# Altium schematic sheet STM32F103C8T6.SchDoc: STM32最小系统
size A4; Author: LiuShiming; Organization: Author:LiuShiming; DocumentNumber: 1; Revision: V2; SheetNumber: 1; SheetTotal: 1; Time: 20220215
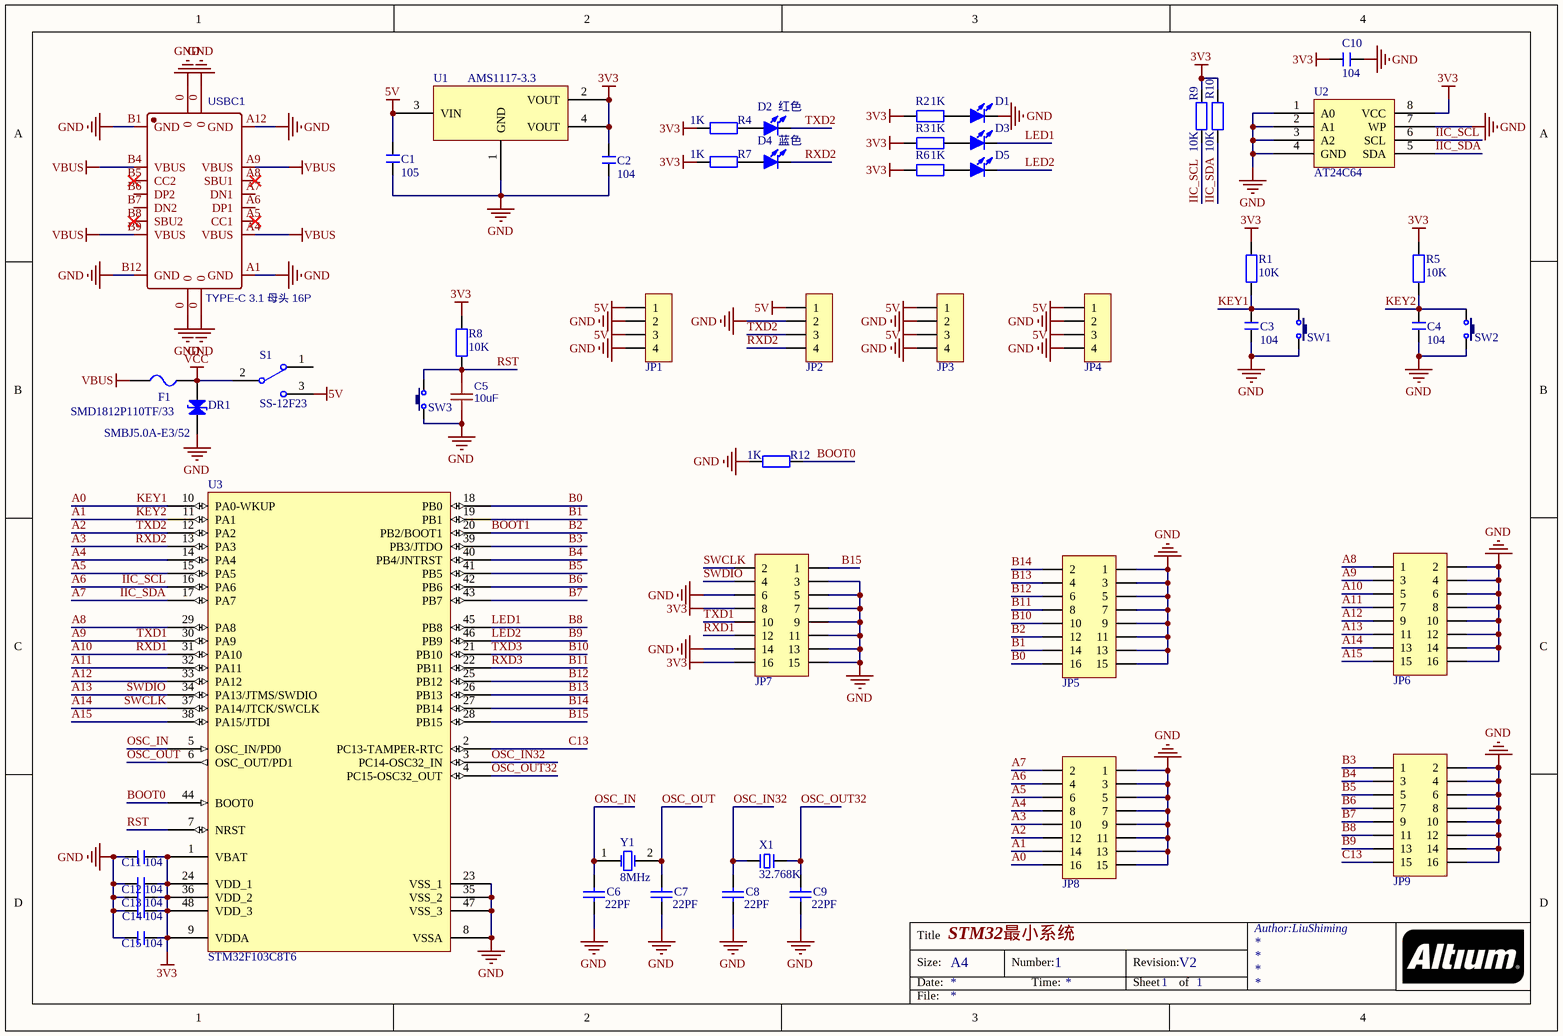
[diagram p0: STM32F103C8T6.SchDoc]

## Parts
C1  105  [C 0603]
C2  104  [C 0603]
C3  104  [C 0603]
C4  104  [C 0603]
C5  10uF  [C 0603]
C6  22PF  [C 0603]
C7  22PF  [C 0603]
C8  22PF  [C 0603]
C9  22PF  [C 0603]
C10  104  [C 0603]
C11  104  [C 0603]
C12  104  [C 0603]
C13  104  [C 0603]
C14  104  [C 0603]
C15  104  [C 0603]
D1  红色  [LED 0603R]  (value not drawn)
D2  红色  [LED 0603R]
D3  蓝色  [LED 0603B]  (value not drawn)
D4  蓝色  [LED 0603B]
D5  黄色  [LED 0603Y]  (value not drawn)
DR1  SMBJ5.0A-E3/52  [SMB]
F1  SMD1812P110TF/33  [FU 0805]
JP1  HDR-1X4  [HDR-1X4]  (value not drawn)
JP2  HDR-1X4  [HDR-1X4]  (value not drawn)
JP3  HDR-1X4  [HDR-1X4]  (value not drawn)
JP4  HDR-1X4  [HDR-1X4]  (value not drawn)
JP5  Header 8X2  [HD8X2]  (value not drawn)
JP6  Header 8X2  [HD8X2]  (value not drawn)
JP7  Header 8X2  [HD8X2]  (value not drawn)
JP8  Header 8X2  [HD8X2]  (value not drawn)
JP9  Header 8X2  [HD8X2]  (value not drawn)
R1  10K  [R 0603]
R2  1K  [R 0603]
R3  1K  [R 0603]
R4  1K  [R 0603]
R5  10K  [R 0603]
R6  1K  [R 0603]
R7  1K  [R 0603]
R8  10K  [R 0603]
R9  10K  [R 0603]
R10  10K  [R 0603]
R12  1K  [R 0603]
S1  SS-12F23  [MSK-12C01-07]
SW1  3x6x5  [TSW SMD-3*6*4.3]  (value not drawn)
SW2  3x6x5  [TSW SMD-3*6*4.3]  (value not drawn)
SW3  3x6x5  [TSW SMD-3*6*4.3]  (value not drawn)
U1  AMS1117-3.3  [SOT223_N]
U2  AT24C64  [SOP8_N]
U3  STM32F103C8T6  [LQFP48_M]
USBC1  TYPE-C 3.1 母头 16P  [USB-TYPE-C_16PIN-MALE-TYPE-C-31-M-12]
X1  32.768K  [XTAL-3X8H]
Y1  8MHz  [XTAL-49S DIP]

## Nets
3V3: C2.2 C10.2 C11.1 C12.1 C13.1 C14.1 C15.1 JP7.8 JP7.16 R1.2 R2.1 R3.1 R4.1 R5.2 R6.1 R7.1 R8.1 R9.1 R10.1 U1.2(VOUT) U1.4(VOUT) U2.8(VCC) U3.1(VBAT) U3.9(VDDA) U3.24(VDD_1) U3.36(VDD_2) U3.48(VDD_3)
5V: C1.2 JP1.1 JP1.3 JP2.1 JP3.1 JP3.3 JP4.1 JP4.3 S1.3 U1.3(VIN)
GND: C1.1 C2.1 C3.1 C4.1 C5.2 C6.2 C7.2 C8.2 C9.2 C10.1 C11.2 C12.2 C13.2 C14.2 C15.2 D1.2(K) DR1.1(A) JP1.2 JP1.4 JP2.2 JP3.2 JP3.4 JP4.2 JP4.4 JP5.1 JP5.3 JP5.5 JP5.7 JP5.9 JP5.11 JP5.13 JP5.15 JP6.2 JP6.4 JP6.6 JP6.8 JP6.10 JP6.12 JP6.14 JP6.16 JP7.3 JP7.5 JP7.6 JP7.7 JP7.9 JP7.11 JP7.13 JP7.14 JP7.15 JP8.1 JP8.3 JP8.5 JP8.7 JP8.9 JP8.11 JP8.13 JP8.15 JP9.2 JP9.4 JP9.6 JP9.8 JP9.10 JP9.12 JP9.14 JP9.16 R12.1 SW1.2 SW2.2 SW3.1 U1.1(GND) U2.1(A0) U2.2(A1) U2.3(A2) U2.4(GND) U2.7(WP) U3.8(VSSA) U3.23(VSS_1) U3.35(VSS_2) U3.47(VSS_3) USBC1.0 USBC1.A1(GND) USBC1.A12(GND) USBC1.B1(GND) USBC1.B12(GND)
VBUS: F1.1 USBC1.A4(VBUS) USBC1.A9(VBUS) USBC1.B4(VBUS) USBC1.B9(VBUS)
VCC: DR1.2(K) F1.2 S1.2
A0: C3.2 JP8.16 R1.1 SW1.1 U3.10(PA0-WKUP)  [also labelled KEY1]
A1: C4.2 JP8.14 R5.1 SW2.1 U3.11(PA1)  [also labelled KEY2]
A2: D2.2(K) JP2.3 JP8.12 U3.12(PA2)  [also labelled TXD2]
A3: D4.2(K) JP2.4 JP8.10 U3.13(PA3)  [also labelled RXD2]
A4: JP8.8 U3.14(PA4)
A5: JP8.6 U3.15(PA5)
A6: JP8.4 R9.2 U2.6(SCL) U3.16(PA6)  [also labelled IIC_SCL]
A7: JP8.2 R10.2 U2.5(SDA) U3.17(PA7)  [also labelled IIC_SDA]
A8: JP6.1 U3.29(PA8)
A9: JP6.3 JP7.10 U3.30(PA9)  [also labelled TXD1]
A10: JP6.5 JP7.12 U3.31(PA10)  [also labelled RXD1]
A11: JP6.7 U3.32(PA11)
A12: JP6.9 U3.33(PA12)
A13: JP6.11 JP7.4 U3.34(PA13/JTMS/SWDIO)  [also labelled SWDIO]
A14: JP6.13 JP7.2 U3.37(PA14/JTCK/SWCLK)  [also labelled SWCLK]
A15: JP6.15 U3.38(PA15/JTDI)
B0: JP5.16 U3.18(PB0)
B1: JP5.14 U3.19(PB1)
B2: JP5.12 U3.20(PB2/BOOT1)  [also labelled BOOT1]
B3: JP9.1 U3.39(PB3/JTDO)
B4: JP9.3 U3.40(PB4/JNTRST)
B5: JP9.5 U3.41(PB5)
B6: JP9.7 U3.42(PB6)
B7: JP9.9 U3.43(PB7)
B8: D3.2(K) JP9.11 U3.45(PB8)  [also labelled LED1]
B9: D5.2(K) JP9.13 U3.46(PB9)  [also labelled LED2]
B10: JP5.10 U3.21(PB10)  [also labelled TXD3]
B11: JP5.8 U3.22(PB11)  [also labelled RXD3]
B12: JP5.6 U3.25(PB12)
B13: JP5.4 U3.26(PB13)
B14: JP5.2 U3.27(PB14)
B15: JP7.1 U3.28(PB15)
BOOT0: R12.2 U3.44(BOOT0)
C13: JP9.15 U3.2(PC13-TAMPER-RTC)
OSC_IN: C6.1 U3.5(OSC_IN/PD0) Y1.1(OSC1)
OSC_IN32: C8.1 U3.3(PC14-OSC32_IN) X1.1
OSC_OUT: C7.1 U3.6(OSC_OUT/PD1) Y1.2(OSC2)
OSC_OUT32: C9.1 U3.4(PC15-OSC32_OUT) X1.2
RST: C5.1 R8.2 SW3.2 U3.7(NRST)
NetD1_1: D1.1(A) R2.2
NetD2_1: D2.1(A) R4.2
NetD3_1: D3.1(A) R3.2
NetD4_1: D4.1(A) R7.2
NetD5_1: D5.1(A) R6.2

Not connected (* = marked no-connect by the designer): S1 1; USBC1 A5(CC1)* A6(DP1) A7(DN1) A8(SBU1)* B5(CC2)* B6(DP2) B7(DN2) B8(SBU2)*

## Notes on the sheet
- Title
- Size:
- Date:
- A4
- Number:
- Time:
- Revision:
- Sheet
- of
- File:

## Library data of the parts
C1-C4 C10-C15 = C: 无极性贴片电容; 版权归属: 源创客; BOM名称: 无极性贴片电容; 学习资源: www.ooocke.com
C5 = 100nF: BOM_Manufacturer: YAGEO; BOM_Manufacturer Part: CC0603GRNPO9BN300; nameAlias: Capacitance; Contributor: LCSC; BOM_Supplier: LCSC; BOM_Supplier Part: C327012; spicePre: C; spiceSymbolName: CC0603GRNPO9BN300
C6-C9 = Cap: Capacitor; Published: 8-Jun-2000; LatestRevisionDate: 17-Jul-2002; LatestRevisionNote: Re-released for DXP Platform.; PackageReference: RAD-0.3; Publisher: Altium Limited
D1 D3 D5 = LED-SMD_1W: 大功率LED; 版权归属: 源创客; BOM名称: 大功率LED; 学习资源: www.ooocke.com
D2 D4 = LED-3MM: 插件LED; 版权归属: 源创客; BOM名称: 插件LED; 学习资源: www.ooocke.com
DR1 = DR: 瞬态电压抑制二极管; 版权归属: 源创客; BOM名称: 瞬态电压抑制二极管; 学习资源: www.ooocke.com
F1 = FU: 贴片保险丝; 版权归属: 源创客; BOM名称: 贴片保险丝; 学习资源: www.ooocke.com
JP1-JP4 = Header 4: 4P接插件; 版权归属: 源创客; BOM名称: 4P接插件; 学习资源: www.ooocke.com
JP5-JP9 = Header 8X2: 8*2P接插件; 版权归属: 源创客; BOM名称: 8*2P接插件; 学习资源: www.ooocke.com
R1 R4 R5 R7 R8 = R: 贴片电阻; 版权归属: 源创客; BOM名称: 贴片电阻; 学习资源: www.ooocke.com
R2 R3 R6 R9 R10 R12 = RX: 大功率电阻; 版权归属: 源创客; BOM名称: 大功率电阻; 学习资源: www.ooocke.com
S1 = SSW-1P: 1路波动开关; BOM名称: 波动开关; 版权归属: 源创客; 学习资源: www.ooocke.com
SW1-SW3 = TSW 3x6: 3x6轻触开关; 版权归属: 源创客; BOM名称: 3x6轻触开关; 学习资源: www.ooocke.com
U1 = AMS11
U3 = STM32F103C8T6: STM32 ARM-based 32-bit MCU with 64 Kbytes Flash, 48-pin LQFP, Industrial Temperature; Published: 30-May-2008; DatasheetVersion: rev6, Mar-2008; PackageVersion: Mar-2008; PackageReference: LQFP48; Publisher: Altium Limited; PackageDescription: 48-Pin Low-Profile Quad Flat Pack, 7 x 7 mm Body, 0.5 mm Pitch (LQFP48); ComponentLink1Description: Manufacturer Link; ComponentLink1URL: www.st.com/stm32; ComponentLink2Description: Datasheet; ComponentLink2URL: http://www.st.com/stonline/products/literature/ds/13587.pdf
X1 = XTAL-2: 2脚晶振; 版权归属: 源创客; BOM名称: 2脚晶振; 学习资源: www.ooocke.com
Y1 = XTAL: Crystal Oscillator; Published: 8-Jun-2000; LatestRevisionDate: 17-Jul-2002; LatestRevisionNote: Re-released for DXP Platform.; PackageReference: R38; Publisher: Altium Limited